# EAGLE schematic torque_sensor (EAGLE 9.6.1)
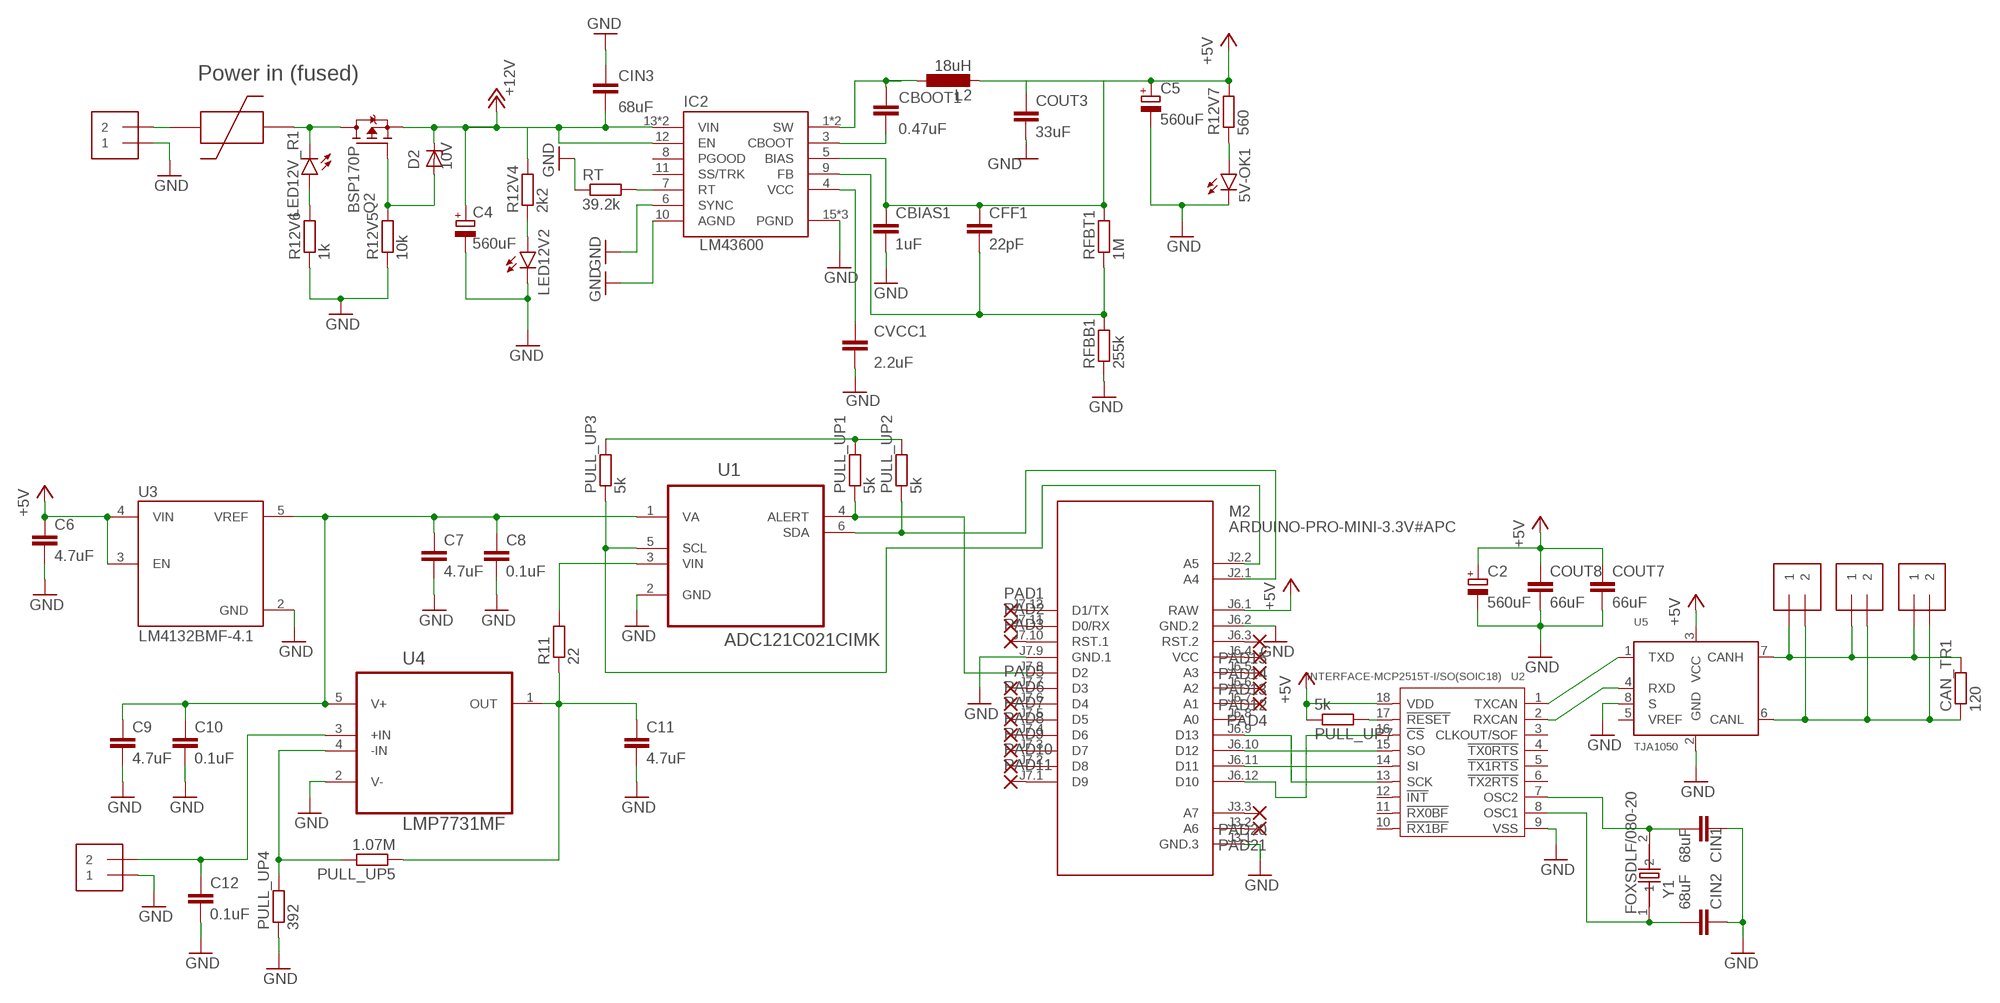
[diagram p0: schematic, sheet 1]

## Parts
5V-OK1  LEDCHIPLED_0805  [CHIPLED_0805]
C2  560uF  CPOL-EUF  [PANASONIC_F]
C4  560uF  CPOL-EUF  [PANASONIC_F]
C5  560uF  CPOL-EUF  [PANASONIC_F]
C6  4.7uF  C-EUC0805  [C0805]
C7  4.7uF  C-EUC0805  [C0805]
C8  0.1uF  C-EUC0805  [C0805]
C9  4.7uF  C-EUC0805  [C0805]
C10  0.1uF  C-EUC0805  [C0805]
C11  4.7uF  C-EUC0805  [C0805]
C12  0.1uF  C-EUC0805  [C0805]
CAN_TR1  120  R-EU_R0805  [R0805]
CBIAS1  1uF  C-EUC0805  [C0805]
CBOOT1  0.47uF  C-EUC0805  [C0805]
CFF1  22pF  C-EUC0805  [C0805]
CIN1  68uF  C-EUC0805  [C0805]
CIN2  68uF  C-EUC0805  [C0805]
CIN3  68uF  C-EUC0805  [C0805]
COUT3  33uF  C-EUC0805  [C0805]
COUT7  66uF  C-EUC0805  [C0805]
COUT8  66uF  C-EUC0805  [C0805]
CVCC1  2.2uF  C-EUC0805  [C0805]
D2  10V  ZENER-DIODESMB  [SMB]
IC2  LM43600  [HTSSOP16]
J3  1X2-3.5MM  [1X2-3.5MM]
J4  1X2-3.5MM  [1X2-3.5MM]
J6  1X2-3.5MM  [1X2-3.5MM]
J7  1X2-3.5MM  [1X2-3.5MM]
J8  1X2-3.5MM  [1X2-3.5MM]
L2  18uH  L-EUL1812  [L1812]
LED12V2  LEDCHIPLED_0805  [CHIPLED_0805]
LED12V_R1  LEDCHIPLED_0805  [CHIPLED_0805]
M2  ARDUINO-PRO-MINI-3.3V#APC  [ARDUINO-PRO-MINI#APC]
PAD1  SMD2  [SMD1,27-2,54]
PAD2  SMD2  [SMD1,27-2,54]
PAD3  SMD2  [SMD1,27-2,54]
PAD4  SMD2  [SMD1,27-2,54]
PAD5  SMD2  [SMD1,27-2,54]
PAD6  SMD2  [SMD1,27-2,54]
PAD7  SMD2  [SMD1,27-2,54]
PAD8  SMD2  [SMD1,27-2,54]
PAD9  SMD2  [SMD1,27-2,54]
PAD10  SMD2  [SMD1,27-2,54]
PAD11  SMD2  [SMD1,27-2,54]
PAD12  SMD2  [SMD1,27-2,54]
PAD13  SMD2  [SMD1,27-2,54]
PAD14  SMD2  [SMD1,27-2,54]
PAD15  SMD2  [SMD1,27-2,54]
PAD20  SMD2  [SMD1,27-2,54]
PAD21  SMD2  [SMD1,27-2,54]
PULL_UP1  5k  R-EU_R0805  [R0805]
PULL_UP2  5k  R-EU_R0805  [R0805]
PULL_UP3  5k  R-EU_R0805  [R0805]
PULL_UP4  392  R-EU_R0805  [R0805]
PULL_UP5  1.07M  R-EU_R0805  [R0805]
PULL_UP7  5k  R-EU_R0805  [R0805]
Q2  BSP170P  [SOT223]
R11  22  R-EU_R0805  [R0805]
R12V4  2k2  R-EU_R0805  [R0805]
R12V5  10k  R-EU_R0805  [R0805]
R12V6  1k  R-EU_R0805  [R0805]
R12V7  560  R-EU_R0805  [R0805]
RFBB1  255k  R-EU_R0805  [R0805]
RFBT1  1M  R-EU_R0805  [R0805]
RT  39.2k  R-EU_R0805  [R0805]
U1  ADC121C021CIMK  [SOT95P285X100-6N]
U2  INTERFACE-MCP2515T-I/SO(SOIC18)  [SOIC18-1.27-11.5X7.5MM]
U3  LM4132BMF-4.1  [SOT95P280X145-5N]
U4  LMP7731MF  [SOT95P284X119-5N]
U5  TJA1050  [SOT96-1]
U$1  SMF_OMNI-BLOK_FUSE_BLOCK  [SMF_OMNI-BLOK_FUSE_BLOCK]
Y1  FOXSDLF/080-20  [XTAL1170X500X450]

## Nets
+5V [signal]: C2.+ C5.+ C6.1 CBIAS1.1 CFF1.1 COUT3.1 COUT7.1 COUT8.1 IC2.5(BIAS) L2.2 M2.J6.1(RAW) PULL_UP7.1 R12V7.2 RFBT1.2 U2.18(VDD) U3.3(EN) U3.4(VIN) U5.3(VCC)
GND: 5V-OK1.C C2.- C4.- C5.- C6.2 C7.2 C8.2 C9.2 C10.2 C11.2 C12.2 CBIAS1.2 CIN1.1 CIN2.1 CIN3.1 COUT3.2 COUT7.2 COUT8.2 CVCC1.2 IC2.6(SYNC) IC2.10(AGND) IC2.15(PGND) IC2.16(PGND) IC2.17(PGND) J3.1 LED12V2.C M2.J3.1(GND.3) M2.J6.2(GND.2) M2.J7.9(GND.1) PULL_UP4.1 R12V5.1 R12V6.1 RFBB1.1 RT.1 U1.2(GND) U2.9(VSS) U3.2(GND) U4.2(V-) U5.2(GND) U5.8(S)
N$1: U2.2(RXCAN) U5.4(RXD)
N$2: CBOOT1.1 IC2.1(SW) IC2.2(SW) L2.1
N$13 [12V]: CIN3.2 IC2.12(EN) IC2.13(VIN) IC2.14(VIN) R12V4.2 ; supply symbol labelled +12V
N$16: CBOOT1.2 IC2.3(CBOOT)
N$18: LED12V2.A R12V4.1
N$19: M2.J2.1(A4)
N$20 [12V]: D2.A Q2.1(G) R12V5.2
N$21: 5V-OK1.A R12V7.1
N$22: J3.2 U$1.PIN1
N$23: LED12V_R1.A R12V6.2
N$24: LED12V_R1.C Q2.2(D) Q2.4(D) U$1.PIN2
N$25: CVCC1.1 IC2.4(VCC)
N$26: IC2.7(RT) RT.2
N$27: CFF1.2 IC2.9(FB) RFBB1.2 RFBT1.1
N$28: C11.1 PULL_UP5.1 R11.1 U4.1(OUT)
N$29: M2.J7.8(D2) PULL_UP1.1 U1.4(ALERT)
N$30: M2.J2.2(A5) PULL_UP3.1 U1.5(SCL)
N$31: PULL_UP2.1 U1.6(SDA)
N$32 [signal]: PULL_UP1.2 PULL_UP2.2 PULL_UP3.2
N$33: C7.1 C8.1 C9.1 C10.1 U1.1(VA) U3.5(VREF) U4.5(V+)
N$34: J4.1 ; supply symbol labelled GND
N$35: PULL_UP4.2 PULL_UP5.2 U4.4(-IN)
N$36: C12.1 J4.2 U4.3(+IN)
N$37: R11.2 U1.3(VIN)
N$38: M2.J7.12(D1/TX) PAD1.1(P)
N$39: M2.J7.11(D0/RX) PAD2.1(P)
N$40: M2.J7.10(RST.1) PAD3.1(P)
N$41: M2.J6.7(A1) PAD4.1(P)
N$42: M2.J7.7(D3) PAD5.1(P)
N$43: M2.J7.6(D4) PAD6.1(P)
N$44: M2.J7.5(D5) PAD7.1(P)
N$45: M2.J7.4(D6) PAD8.1(P)
N$46: M2.J7.3(D7) PAD9.1(P)
N$47: M2.J7.2(D8) PAD10.1(P)
N$48: M2.J7.1(D9) PAD11.1(P)
N$49: M2.J6.6(A2) PAD12.1(P)
N$50: M2.J6.5(A3) PAD13.1(P)
N$51: M2.J6.4(VCC) PAD14.1(P)
N$52: M2.J6.3(RST.2) PAD15.1(P)
N$57: M2.J3.3(A7) PAD20.1(P)
N$58: M2.J3.2(A6) PAD21.1(P)
N$77: M2.J6.10(D12) U2.15(SO)
N$78: M2.J6.11(D11) U2.14(SI)
N$79: M2.J6.12(D10) U2.16(!CS)
N$80: M2.J6.9(D13) U2.13(SCK)
N$81: PULL_UP7.2 U2.17(!RESET)
N$82: U2.1(TXCAN) U5.1(TXD)
N$83: CIN1.2 U2.7(OSC2) Y1.2
N$84 [12V]: C4.+ D2.C Q2.3(S)
N$100: CIN2.2 U2.8(OSC1) Y1.1
N$102: CAN_TR1.2 J6.1 J7.1 J8.1 U5.7(CANH)
N$103: CAN_TR1.1 J6.2 J7.2 J8.2 U5.6(CANL)
Unconnected: IC2.8(PGOOD) IC2.11(SS/TRK) M2.J6.8(A0) U2.3(CLKOUT/SOF) U2.4(!TX0RTS) U2.5(!TX1RTS) U2.6(!TX2RTS) U2.10(!RX1BF) U2.11(!RX0BF) U2.12(!INT) U5.5(VREF)

## Notes on the sheet
- Power in (fused)

## Library data of the parts
5V-OK1 LED12V2 LED12V_R1 = led:LED: LED OSRAM: - CHIPLED LG R971, LG N971, LY N971, LG Q971, LY Q971, LO R971, LY R971 LH N974, LH R974 LS Q976, LO Q976, LY Q976 LO Q996 - Hyper CHIPLED LW Q18S LB Q993, LB Q99A, LB R99A - SideLED LS A670, LO A670, LY A670, LG A670, LP A670 LB A673, LV A673, LT A673, LW A673 LH A674 LY A675 LS A676, LA A676, LO A676, LY A676, LW A676 LS A679, LY A679, LG A679 - Hyper Micro SIDELED® LS Y876, LA Y876, LO Y876, LY Y876 LT Y87S - SmartLED LW L88C, LW L88S LB L89C, LB L89S, LG L890 LS L89K, LO L89K, LY L89K LS L896, LA L896, LO L896, LY L896 - TOPLED LS T670, LO T670, LY T670, LG T670, LP T670 LSG T670, LSP T670, LSY T670, LOP T670, LYG T670 LG T671, LOG T671, LSG T671 LB T673, LV T673, LT T673, LW T673 LH T674 LS T676, LA T676, LO T676, LY T676, LB T676, LH T676, LSB T676, LW T676 LB T67C, LV T67C, LT T67C, LS T67K, LO T67K, LY T67K, LW E67C LS E67B, LA E67B, LO E67B, LY E67B, LB E67C, LV E67C, LT E67C LW T67C LS T679, LY T679, LG T679 LS T770, LO T770, LY T770, LG T770, LP T770 LB T773, LV T773, LT T773, LW T773 LH T774 LS E675, LA E675, LY E675, LS T675 LS T776, LA T776, LO T776, LY T776, LB T776 LHGB T686 LT T68C, LB T68C - Hyper Mini TOPLED® LB M676 - Mini TOPLED Santana® LG M470 LS M47K, LO M47K, LY M47K Source: http://www.osram.convergy.de LUXEON: - LUMILED® LXK2-PW12-R00, LXK2-PW12-S00, LXK2-PW14-U00, LXK2-PW14-V00 LXK2-PM12-R00, LXK2-PM12-S00, LXK2-PM14-U00 LXK2-PE12-Q00, LXK2-PE12-R00, LXK2-PE12-S00, LXK2-PE14-T00, LXK2-PE14-U00 LXK2-PB12-K00, LXK2-PB12-L00, LXK2-PB12-M00, LXK2-PB14-N00, LXK2-PB14-P00, LXK2-PB14-Q00 LXK2-PR12-L00, LXK2-PR12-M00, LXK2-PR14-Q00, LXK2-PR14-R00 LXK2-PD12-Q00, LXK2-PD12-R00, LXK2-PD12-S00 LXK2-PH12-R00, LXK2-PH12-S00 LXK2-PL12-P00, LXK2-PL12-Q00, LXK2-PL12-R00 Source: www.luxeon.com KINGBRIGHT: KA-3528ASYC Source: www.kingbright.com
C2 C4 C5 = rcl:CPOL-EU: POLARIZED CAPACITOR, European symbol; SPICEPREFIX: C
C6-C12 CBIAS1 CBOOT1 CFF1 CIN1-CIN3 COUT3 COUT7 COUT8 CVCC1 = rcl:C-EU: CAPACITOR, European symbol; SPICEPREFIX: C
CAN_TR1 PULL_UP1-PULL_UP5 PULL_UP7 R11 R12V4-R12V7 RFBB1 RFBT1 RT = rcl:R-EU_: RESISTOR, European symbol; SPICEPREFIX: R
D2 = diode:ZENER-DIODE: Z-Diode
IC2 = texas-lm43600:LM43600: The LM43600 SIMPLE SWITCHER® regulator is an easy to use synchronous step-down DC-DC converter capable of driving up to 0.5 A of load current from an input voltage ranging from 3.5 V to 36 V (42 V transient). The LM43600 provides exceptional efficiency, output accuracy and drop-out voltage in a very small solution size. The library has been designed by Richard Magdycz <https://www.facebook.com/groups/eaglecadsoftUK>
J3 J4 J6-J8 = adafruit:1X2: 3.5mm Terminal block http://www.ladyada.net/library/pcb/eaglelibrary.html
L2 = rcl:L-EU: INDUCTOR, European symbol; SPICEPREFIX: L
M2 = diy-modules:ARDUINO-PRO-MINI-*#APC: Arduino Pro Mini (and compatible devices) with angle programming connector More details available here: https://www.arduino.cc/en/Main/ArduinoBoardProMini Click here to find device on ebay.com <http://www.ebay.com/sch/arduino+pro+mini>
PAD1-PAD15 PAD20 PAD21 = wirepad:SMD2: SMD PAD
Q2 = transistor-fet:BSP170P: SIPMOS(R) Small-Signal-Transistor P-Channel, Enhancement mode Source: http://www.infineon.com/upload/Document/BSP170P_Rev2.4.pdf
U1 = ADC121C021CIMK:ADC121C021CIMK: 12-Bit Analog-to-Digital Converter; AVAILABILITY: Unavailable; DESCRIPTION: 12 Bit Analog to Digital Converter 1 Input 1 SAR TSOT-23-6; MF: Texas Instruments; MP: ADC121C021CIMK; PACKAGE: TSOT-23-6 Texas Instruments; PRICE: None
U2 = INTERFACE-MCP2515T-I_SO_SOIC18_:INTERFACE-MCP2515T-I/SO(SOIC18): 310070025; AVAILABILITY: Unavailable; DESCRIPTION: CANbus Controller CAN 2.0 SPI Interface 18-SOIC; MF: Microchip; MP: MCP2515T-I/SO; PACKAGE: SOIC-18 Microchip; PRICE: None
U3 = LM4132BMF-4.1:LM4132BMF-4.1: Voltage Reference, Precision, Low Dropout, Series - Fixed, LM4132 Series, 4.096V, SOT-23-5; AVAILABILITY: Unavailable; DESCRIPTION: Series Voltage Reference IC ±0.1% SOT-23-5; MF: Texas Instruments; MP: LM4132BMF-4.1; PACKAGE: SOT-23 Texas Instruments; PRICE: None
U4 = LMP7731MF:LMP7731MF: Amplifier; AVAILABILITY: Unavailable; DESCRIPTION: Ic Amp Prec Rrio Ln Sgl Sot23-5 - Lmp7731mf/Nopb; MF: Texas Instruments; MP: LMP7731MF; PACKAGE: SOT-23 Texas Instruments; PRICE: None
U5 = TJA1050:TJA1050: High speed CAN transceiver The TJA1050 is the interface between the Controller Area Network (CAN) protocol controller and the physical bus. The device provides differential transmit capability to the bus and differential receive capability to the CAN controller. The TJA1050 is the third Philips high-speed CAN transceiver after the PCA82C250 and the PCA82C251. The most important differences are: Much lower electromagnetic emission due to optimal matching of the output signals CANH and CANL Improved behaviour in case of an unpowered node No standby mode. This makes the TJA1050 eminently suitable for use in nodes that are in a power-down situation in partially powered networks. AAL Eindhoven MK; AVAILABILITY: Unavailable; DESCRIPTION: 1/1 Transceiver Half CANbus 8-SO; MF: NXP USA; MP: TJA1050; PACKAGE: SOIC-8 NXP USA; PRICE: None
U$1 = SMF_OMNI-BLOK_FUSE_BLOCK:SMF_OMNI-BLOK_FUSE_BLOCK
Y1 = FOXSDLF_080-20:FOXSDLF/080-20: Crystal 8MHz 30ppm (Tol) 50ppm (Stability) 20pF FUND 80Ohm 2-Pin HC-49/SDLF SMD T/R; AVAILABILITY: Unavailable; DESCRIPTION: 8MHz ±30ppm Crystal 20pF 80 Ohms HC-49/US; MF: Fox Electronics; MP: FOXSDLF/080-20; PACKAGE: HC-49/US Fox Electronics; PRICE: None

## Net classes
1 signal: width 0.3 mm, drill 0.4 mm, clearance 0.25 mm
2 12V: width 1 mm, drill 1.1 mm, clearance 0.25 mm